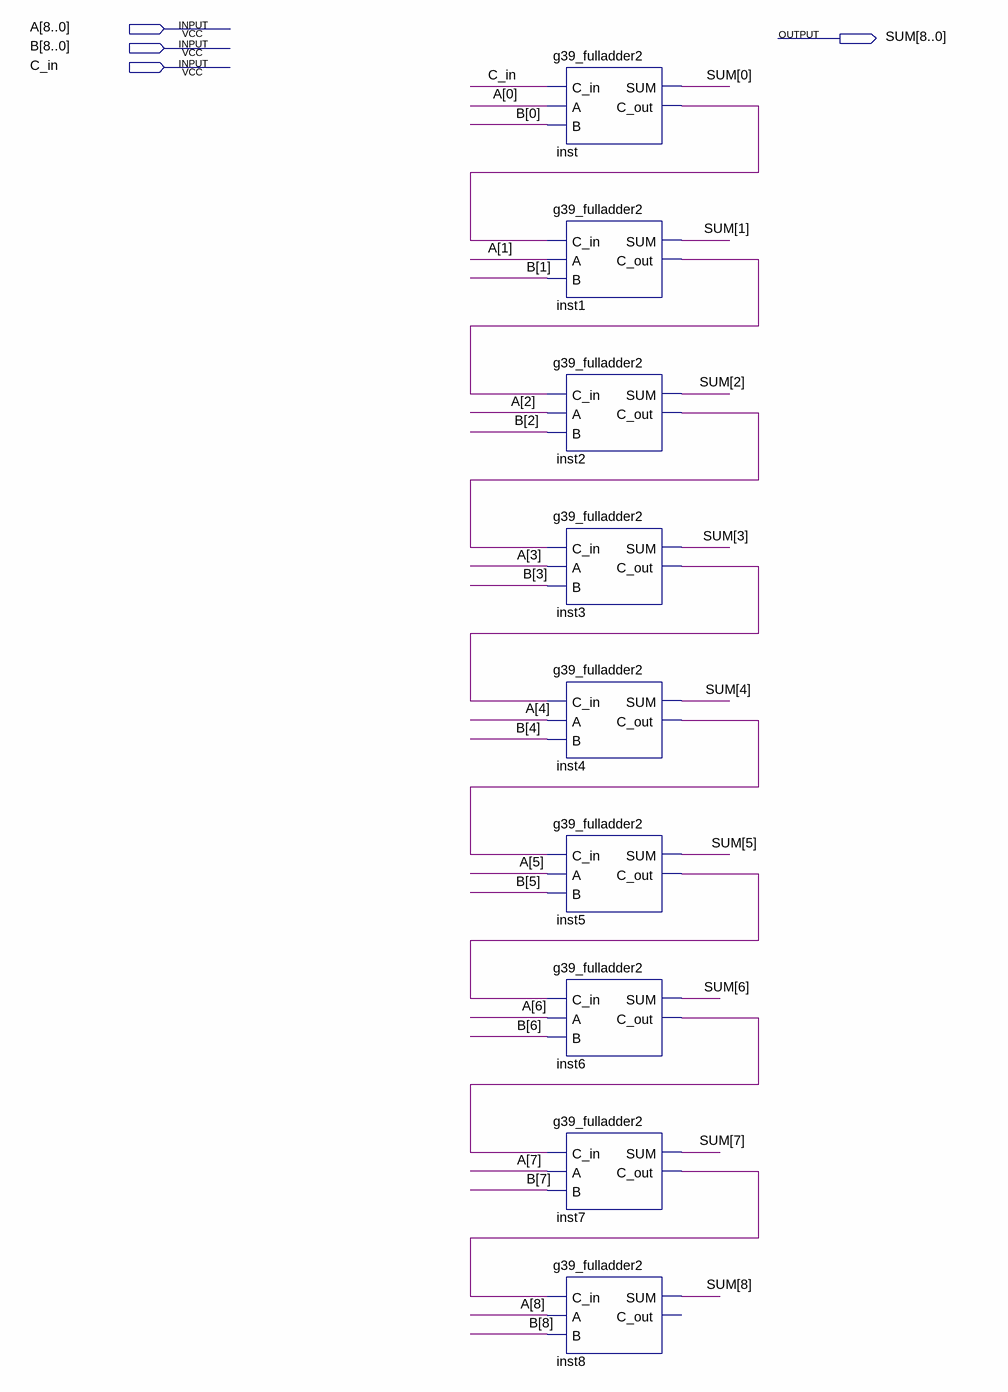
[diagram p0: schematic sheet]
// Quartus schematic g39_adder9.bdf as structural Verilog: 9 symbols, 4 pins
module g39_adder9 (
  input  [8:0] A,
  input  [8:0] B,
  input  C_in,
  output [8:0] SUM
);

  wire inst1_c_out, inst2_c_out, inst3_c_out, inst4_c_out, inst5_c_out, inst6_c_out, inst7_c_out, inst_c_out;

  g39_fulladder2 inst (.C_in(C_in), .A(A[0]), .B(B[0]), .C_out(inst_c_out), .SUM(SUM[0]));
  g39_fulladder2 inst1 (.C_in(inst_c_out), .A(A[1]), .B(B[1]), .C_out(inst1_c_out), .SUM(SUM[1]));
  g39_fulladder2 inst2 (.C_in(inst1_c_out), .A(A[2]), .B(B[2]), .C_out(inst2_c_out), .SUM(SUM[2]));
  g39_fulladder2 inst3 (.C_in(inst2_c_out), .A(A[3]), .B(B[3]), .C_out(inst3_c_out), .SUM(SUM[3]));
  g39_fulladder2 inst4 (.C_in(inst3_c_out), .A(A[4]), .B(B[4]), .C_out(inst4_c_out), .SUM(SUM[4]));
  g39_fulladder2 inst5 (.C_in(inst4_c_out), .A(A[5]), .B(B[5]), .C_out(inst5_c_out), .SUM(SUM[5]));
  g39_fulladder2 inst6 (.C_in(inst5_c_out), .A(A[6]), .B(B[6]), .C_out(inst6_c_out), .SUM(SUM[6]));
  g39_fulladder2 inst7 (.C_in(inst6_c_out), .A(A[7]), .B(B[7]), .C_out(inst7_c_out), .SUM(SUM[7]));
  g39_fulladder2 inst8 (.C_in(inst7_c_out), .A(A[8]), .B(B[8]), .SUM(SUM[8]));  // open: C_out
endmodule
